# Altium schematic sheet AUDIO.SchDoc: param:Title
size A4; Author: param.Autor; Version: param:Version
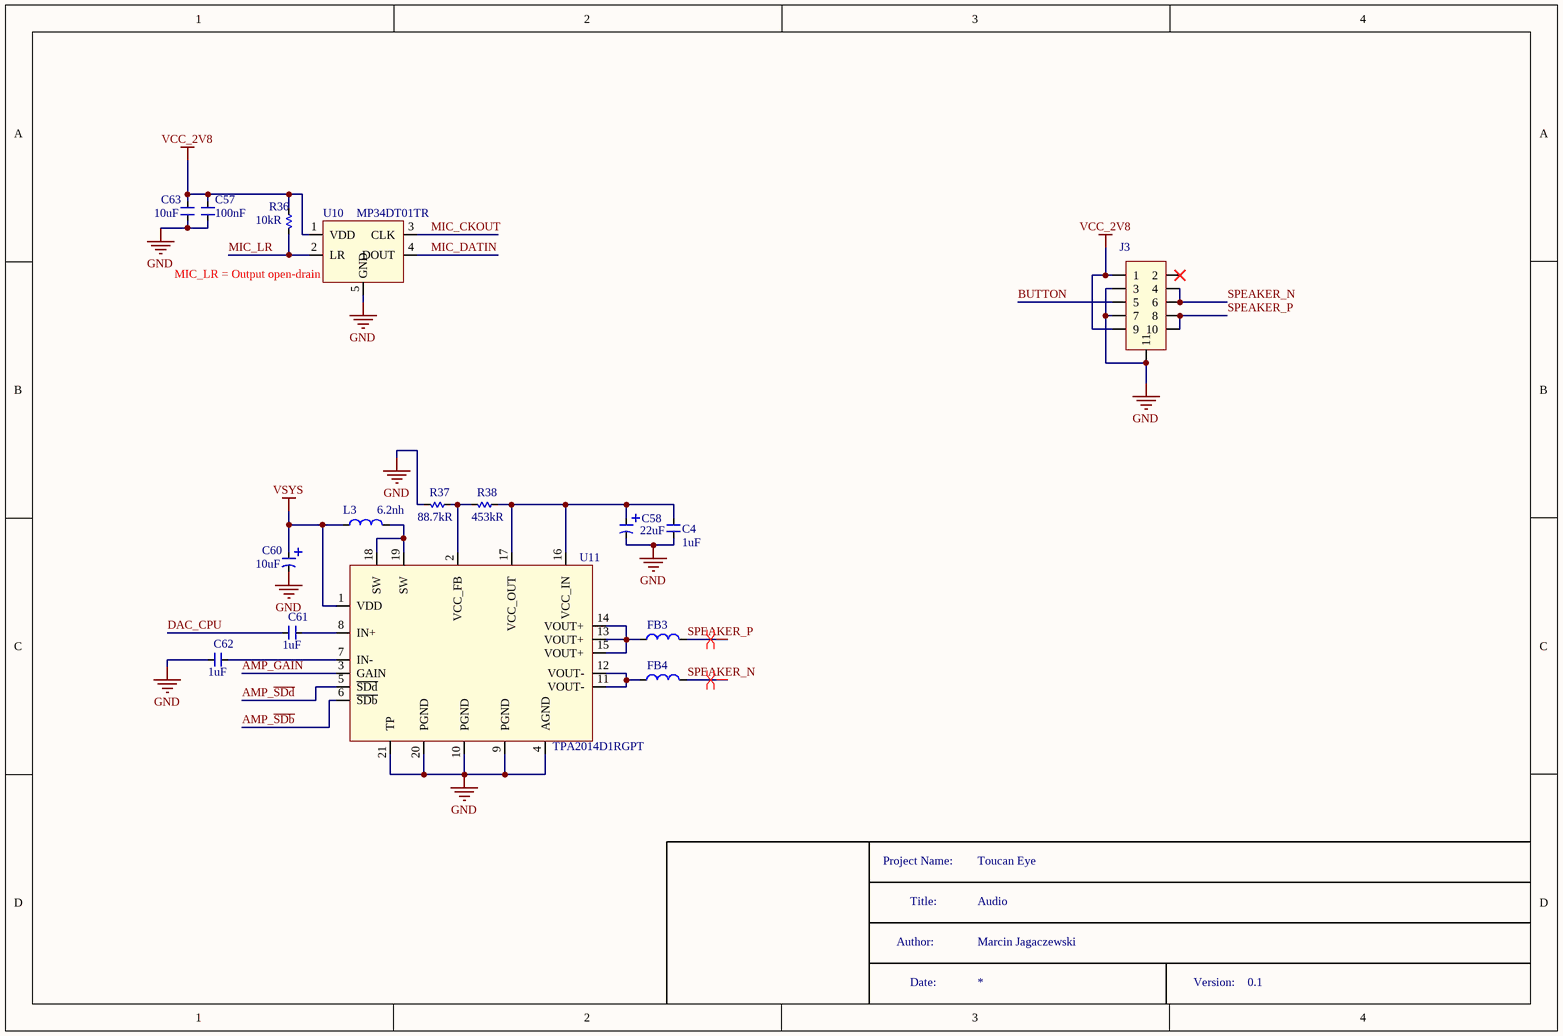
[diagram p0: AUDIO.SchDoc]

## Parts
C4  Capacitance: 1uF  [C_0402]  (hidden comment: C0402_1uF_TMK105BJ105MV-F)
C57  Capacitance: 100nF  [C_0201]  (hidden comment: C0201_100n_GRM033R6YA104KE14D)
C58  Capacitance: 22uF  [C_3216]  (hidden comment: C_22u_TANTAL_A_T491A226K006AT)
C60  Capacitance: 10uF  [C_3216]  (hidden comment: C_10u_TANTAL_A_T491A106K010AT7280)
C61  Capacitance: 1uF  [C_0402]  (hidden comment: C0402_1uF_TMK105BJ105MV-F)
C62  Capacitance: 1uF  [C_0402]  (hidden comment: C0402_1uF_TMK105BJ105MV-F)
C63  Capacitance: 10uF  [C_0402]  (hidden comment: C0402_10u_GRM155C80J106ME11D)
FB3  BLM18EG121SN1D  [L_0603]  (value not drawn)
FB4  BLM18EG121SN1D  [L_0603]  (value not drawn)
J3  BM10NB(0.6)-10DS-0.4V(51)  [BM10NB(0.6)-10DS-0.4V(51)]  (value not drawn)
L3  Inductance: 6.2nh  [L_0402]  (hidden comment: 744765062A)
R36  Resistance: 10kR  [R_0201]  (hidden comment: R0201_10k_ERJ-1GNF1002C)
R37  Resistance: 88.7kR  [R_0201]  (hidden comment: R0201_88.7k_ERJ-1GNF8872C)
R38  Resistance: 453kR  [R_0201]  (hidden comment: R0201_453k_RC0201FR-07453KL)
U10  MP34DT01TR  [HCLGA]
U11  TPA2014D1RGPT  [QFN_16x0,5]

## Nets
GND: C4.1 C57.1 C58.2 C60.2 C62.1 C63.1 J3.3 J3.7 J3.11 R37.1 U10.5(GND) U11.4(AGND) U11.9(PGND) U11.10(PGND) U11.20(PGND) U11.21(TP)
VCC_2V8: C57.2 C63.2 J3.1 J3.9 R36.2 U10.1(VDD)
VSYS: C60.1 L3.1(Vcc) U11.1(VDD)
AMP_GAIN: U11.3(GAIN)
AMP_~{SDb}: U11.6(~{SDb})
AMP_~{SDd}: U11.5(~{SDd})
BUTTON: J3.5
DAC_CPU: C61.1
MIC_CKOUT: U10.3(CLK)
MIC_DATIN: U10.4(DOUT)
MIC_LR: R36.1 U10.2(LR)
SPEAKER_N: FB4.2(Vcc) J3.4 J3.6
SPEAKER_P: FB3.2(Vcc) J3.8 J3.10
NetC4_2: C4.2 C58.1 R38.2 U11.16(VCC_IN) U11.17(VCC_OUT)
NetC61_2: C61.2 U11.8(IN+)
NetC62_2: C62.2 U11.7(IN-)
NetFB3_1: FB3.1(Vcc) U11.13(VOUT+) U11.14(VOUT+) U11.15(VOUT+)
NetFB4_1: FB4.1(Vcc) U11.11(VOUT-) U11.12(VOUT-)
NetL3_2: L3.2(Vcc) U11.18(SW) U11.19(SW)
NetR37_2: R37.2 R38.1 U11.2(VCC_FB)

Not connected (* = marked no-connect by the designer): J3 2*

## Layout directives
differential pair: SPEAKER_N, SPEAKER_P

## Notes on the sheet
- (near U10) MIC_LR = Output open-drain
- Project Name:
- Title:
- Audio
- Toucan Eye
- Author:
- Date:
- Marcin Jagaczewski
- Version:
- 0.1

## Library data of the parts
C4 C61 C62 = C0402_1uF_TMK105BJ105MV-F: CAP CER 1UF 25V X5R 0402; Manufacturer: Taiyo Yuden; Tolerance: 20%; *PCBChecked: 1; Supplier 1: Mouser; Manufacturer Part Number: TMK105BJ105MV-F; Stock 1: 60117; Pricing 1: 1=0.28, 10=0.098, 50=0.098, 100=0.054, 1000=0.028, 10000=0.019 (USD); Mount: Surface Mount; Case/Package: 0402; Case Code (Metric): 1005; Case Code (Imperial): 0402; Min Operating Temperature: -55°C; Max Operating Temperature: 85°C; Packaging: Tape and Reel; Package Quantity: 1; Voltage Rating (DC): 25V; Dielectric: X5R; Termination: SMD/SMT; Voltage Rating: 25V; Composition: Ceramic; Length: 1mm; Height: 0.5mm; Width: 0.02inch; Thickness: 0.022inch; Depth: 0.5mm; Radiation Hardening: No; Halogen Free: Halogen Free; ComponentLink1URL: https://datasheet.ciiva.com/30154/128tmk105bj105mv-f-30154639.pdf; ComponentLink1Description: https://datasheet.ciiva.com/30154/128tmk105bj105mv-f-30154639.pdf; ComponentLink2URL: https://datasheet.ciiva.com/15922/tmk105bj105mv-f-pdf-15922317.pdf; ComponentLink2Description: https://datasheet.ciiva.com/15922/tmk105bj105mv-f-pdf-15922317.pdf; ComponentLink3URL: https://datasheet.ciiva.com/11596/tmk105bj105mv-f-ss-11596466.pdf; ComponentLink3Description: https://datasheet.ciiva.com/11596/tmk105bj105mv-f-ss-11596466.pdf; ComponentLink4URL: https://datasheet.ciiva.com/13404/mlcc-all-e-541559-13404206.pdf; ComponentLink4Description: https://datasheet.ciiva.com/13404/mlcc-all-e-541559-13404206.pdf; *SCHChecked: 1; Supplier Part Number 1: 963-TMK105BJ105MV-F
C57 = C0201_100n_GRM033R6YA104KE14D: Multilayer Ceramic Capacitors MLCC - SMD/SMT 0201 0.10uF 35volts *Derate Voltage/Temp; Manufacturer: Murata; Tolerance: 10%; Dielectric: X5R; Voltage Rating (DC): 35V; Supplier 1: Mouser; Manufacturer Part Number: GRM033R6YA104KE14D; Stock 1: 295799; Pricing 1: 1=0.1, 10=0.061, 50=0.061, 100=0.027, 1000=0.015, 10000=0.01 (USD); Mount: Surface Mount; Case/Package: 0201; Weight: 1.2E-05oz; Case Code (Metric): 0603; Case Code (Imperial): 0201; Min Operating Temperature: -55°C; Max Operating Temperature: 85°C; Packaging: Tape and Reel; Voltage Rating: 35V; Termination: SMD/SMT; Package Quantity: 15000; Length: 0.024inch; Height: 0.3mm; Width: 0.3mm; Thickness: 0.013inch; ComponentLink1URL: http://www.mouser.com/ds/2/281/c02e-2905.pdf; ComponentLink1Description: http://www.mouser.com/ds/2/281/c02e-2905.pdf; ComponentLink2URL: http://search.murata.co.jp/Ceramy/image/img/A01X/partnumbering_e_01.pdf; ComponentLink2Description: http://search.murata.co.jp/Ceramy/image/img/A01X/partnumbering_e_01.pdf; *SCHChecked: *; *PCBChecked: *; Supplier Part Number 1: 81-GRM33R6YA104KE14D
C58 = C_22u_TANTAL_A_T491A226K006AT: Cap Tant Solid 22uF 6.3V A CASE 10% (3.2 X 1.6 X 1.6mm) SMD 3216-18 4 Ohm 125C T/R; Manufacturer: KEMET; Dielectric Material: Tantalum; ESR (Equivalent Series Resistance): 4R; Ripple Current: 137mA; Leakage Current: 1.4uA; Polarity: Polar; Dissipation Factor: 6%; Life (Hours): 2000Hour; *PCBChecked: 1; Supplier 1: Mouser; Manufacturer Part Number: T491A226K006AT; Stock 1: 2818; Pricing 1: 1=0.42, 10=0.239, 50=0.239, 100=0.144, 1000=0.118, 10000=0.08 (USD); Mount: Surface Mount,PCB; Case/Package: 1206; Number of Pins: 2; Case Code (Metric): 3216; Case Code (Imperial): 1206; Min Operating Temperature: -55°C; Max Operating Temperature: 125°C; Tolerance: 10%; Packaging: Tape and Reel; Voltage Rating: 6.3V; Package Quantity: 1; Failure Rate: 0.001%; Termination: SMD/SMT; Voltage: 6.3V; Voltage Rating (DC): 6.3V; Length: 3.2mm; Height: 1.6mm; Depth: 1.6mm; Width: 0.063inch; Height - Seated (Max): 0.071inch; Lead Pitch: 1.2mm; Radiation Hardening: No; Lead Free: Lead Free; REACH SVHC: No SVHC; ComponentLink1URL: https://datasheet.ciiva.com/12884/kem-t2005-t491-12884456.pdf; ComponentLink1Description: https://datasheet.ciiva.com/12884/kem-t2005-t491-12884456.pdf; ComponentLink2URL: https://datasheet.ciiva.com/6248/kem-t2005-t491-6248094.pdf; ComponentLink2Description: https://datasheet.ciiva.com/6248/kem-t2005-t491-6248094.pdf; ComponentLink3URL: https://datasheet.ciiva.com/28488/1854511-28488485.pdf; ComponentLink3Description: https://datasheet.ciiva.com/28488/1854511-28488485.pdf; ComponentLink4URL: https://datasheet.ciiva.com/5934/kem-t2005-t491-5934246.pdf; ComponentLink4Description: https://datasheet.ciiva.com/5934/kem-t2005-t491-5934246.pdf; *SCHChecked: 1; Supplier Part Number 1: 80-T491A226K006
C60 = C_10u_TANTAL_A_T491A106K010AT7280: CAP TANT 10UF 10V 10% 1206; Manufacturer: KEMET; ESR (Equivalent Series Resistance): 3.8R; Polarity: Polar; Dissipation Factor: 6%; Life (Hours): 2000Hour; Supplier 1: Mouser; Manufacturer Part Number: T491A106K010AT7280; Stock 1: 0; Pricing 1: 1=0.39, 10=0.223, 50=0.223, 100=0.134, 1000=0.096, 10000=0.074 (USD); Mount: Surface Mount; Case/Package: 1206; Case Code (Metric): 3216; Case Code (Imperial): 1206; Min Operating Temperature: -55°C; Max Operating Temperature: 125°C; Tolerance: 10%; Packaging: Tape and Reel; Voltage Rating: 10V; Package Quantity: 1; Termination: SMD/SMT; Resistance: 3.8R; Failure Rate: 0.001%; Length: 3.2mm; Height: 1.8mm; Depth: 1.6mm; Width: 0.063inch; Height - Seated (Max): 0.071inch; Lead Free: Lead Free; ComponentLink1URL: https://datasheet.ciiva.com/12911/kem-t2005-t491-12911022.pdf; ComponentLink1Description: https://datasheet.ciiva.com/12911/kem-t2005-t491-12911022.pdf; ComponentLink2URL: https://datasheet.ciiva.com/6248/kem-t2005-t491-6248182.pdf; ComponentLink2Description: https://datasheet.ciiva.com/6248/kem-t2005-t491-6248182.pdf; *SCHChecked: *; *PCBChecked: *; Supplier Part Number 1: 80-T491A106K107280
C63 = C0402_10u_GRM155C80J106ME11D: 10µF 6.3V Ceramic Capacitor X6S 0402 (1005 Metric) 0.039" L x 0.020" W (1.00mm x 0.50mm); Manufacturer: Murata; Tolerance: 20%; *SCHChecked: 1; Supplier 1: Mouser; Manufacturer Part Number: GRM155C80J106ME11D; Stock 1: 134415; Pricing 1: 1=0.17, 10=0.125, 50=0.125, 100=0.059, 1000=0.034, 10000=0.024 (USD); Mount: Surface Mount; Case/Package: 0402; Case Code (Metric): 1005; Case Code (Imperial): 0402; Min Operating Temperature: -55°C; Max Operating Temperature: 105°C; Packaging: Tape and Reel; Voltage Rating: 6.3V; Voltage Rating (DC): 6.3V; Dielectric: X6S; Length: 0.039inch; Width: 0.02inch; Thickness: 0.028inch; ComponentLink1URL: http://search.murata.co.jp/Ceramy/image/img/A01X/partnumbering_e_01.pdf; ComponentLink1Description: http://search.murata.co.jp/Ceramy/image/img/A01X/partnumbering_e_01.pdf; Supplier Part Number 1: 81-GRM155C80J106ME1D; *PCBChecked: 1
FB3 FB4 = BLM18EG121SN1D: MURATA         BLM18EG121SN1D            FERRITE BEAD, 0.04OHM, 2A, 0603; Material: Steel,Ferrite; DC Resistance (DCR): 40mR; Impedance: 120R; Tolerance: 25%; Test Frequency: 100MHz; Number of Lines: 1; Supplier 1: Mouser; Manufacturer: Murata; Manufacturer Part Number: BLM18EG121SN1D; Stock 1: 9180; Pricing 1: 1=0.23, 10=0.134, 50=0.134, 100=0.095, 1000=0.073, 10000=0.058 (USD); Case/Package: 0603; Number of Pins: 2; Weight: 7.1E-05oz; Core Material: Ferrite; Case Code (Metric): 1608; Case Code (Imperial): 0603; Min Operating Temperature: -55°C; Max Operating Temperature: 125°C; Packaging: Tape and Reel; Current Rating: 2A; Max DC Current: 2A; Package Quantity: 1; Max Current Rating: 2A; Termination: SMD/SMT; DC Current: 2A; Military Standard: Not; Frequency: 100MHz; Number of Circuits: 1; Length: 1.6mm; Height: 0.8mm; Width: 0.8mm; Depth: 0.8mm; Radiation Hardening: No; REACH SVHC: No SVHC; Lead Free: Lead Free; ComponentLink1URL: https://datasheet.ciiva.com/34302/1844926-34302803.pdf; ComponentLink1Description: https://datasheet.ciiva.com/34302/1844926-34302803.pdf; ComponentLink2URL: https://datasheet.ciiva.com/11795/0900766b811b5866-11795397.pdf; ComponentLink2Description: https://datasheet.ciiva.com/11795/0900766b811b5866-11795397.pdf; ComponentLink3URL: https://datasheet.ciiva.com/41449/001172264-da-01-en-drossel-0603-120r-1-6x0-8mm-4000st-41449582.pdf; ComponentLink3Description: https://datasheet.ciiva.com/41449/001172264-da-01-en-drossel-0603-120r-1-6x0-8mm-4000st-41449582.pdf; ComponentLink4URL: https://datasheet.ciiva.com/41449/001171698-da-01-en-chip-drossel0603-120r-2000ma-1-6x0-8mm-41449378.pdf; ComponentLink4Description: https://datasheet.ciiva.com/41449/001171698-da-01-en-chip-drossel0603-120r-2000ma-1-6x0-8mm-41449378.pdf; ComponentLink5URL: https://datasheet.ciiva.com/14122/blm-series-eng-tds-14122904.pdf; ComponentLink5Description: https://datasheet.ciiva.com/14122/blm-series-eng-tds-14122904.pdf; ComponentLink6URL: https://datasheet.ciiva.com/3081/l0110s0101blm18e-3081624.pdf; ComponentLink6Description: https://datasheet.ciiva.com/3081/l0110s0101blm18e-3081624.pdf; ComponentLink7URL: https://datasheet.ciiva.com/17279/l0110s0101blm18e-17279548.pdf; ComponentLink7Description: https://datasheet.ciiva.com/17279/l0110s0101blm18e-17279548.pdf; ComponentLink8URL: https://datasheet.ciiva.com/18092/getdatasheetpartid-120977-18092965.pdf; ComponentLink8Description: https://datasheet.ciiva.com/18092/getdatasheetpartid-120977-18092965.pdf; ComponentLink9URL: https://datasheet.ciiva.com/1467/5169-1467155.pdf; ComponentLink9Description: https://datasheet.ciiva.com/1467/5169-1467155.pdf; ComponentLink10URL: https://datasheet.ciiva.com/1467/5169-1467156.pdf; ComponentLink10Description: https://datasheet.ciiva.com/1467/5169-1467156.pdf; ComponentLink11URL: https://datasheet.ciiva.com/16387/l0110s0101blm18e-16387655.pdf; ComponentLink11Description: https://datasheet.ciiva.com/16387/l0110s0101blm18e-16387655.pdf; ComponentLink12URL: https://datasheet.ciiva.com/6211/l0110s0101blm18e-6211463.pdf; ComponentLink12Description: https://datasheet.ciiva.com/6211/l0110s0101blm18e-6211463.pdf; *SCHChecked: 1; *PCBChecked: 1; Supplier Part Number 1: 81-BLM18EG121SN1D
J3 = BM10NB(0.6)-10DS-0.4V(51): CONN RCPT 10POS 0.4MM SMD GOLD; Manufacturer: Hirose; Number of Positions: 10; Connector Type: Receptacle; Pitch: 0.016inch; Stack Height: 0.6mm; *SCHChecked: 1; Supplier 1: Mouser; Manufacturer Part Number: BM10NB(0.6)-10DS-0.4V(51); Stock 1: 3831; Pricing 1: 1=0.63, 10=0.501, 50=0.501, 100=0.414, 1000=0.326, 10000=0.263 (USD); Mount: Surface Mount; Contact Plating: Gold; Package Quantity: 1; Number of Rows: 2; Packaging: Tape and Reel; Termination: SMD/SMT; ComponentLink1URL: http://www.mouser.com/catalog/specsheets/BM10_Flyer.pdf; ComponentLink1Description: http://www.mouser.com/catalog/specsheets/BM10_Flyer.pdf; ComponentLink2URL: https://www.hirose.com/product/download/?distributor=digikey&type=2d&lang=en&num=BM10NB(0.6)-10DS-0.4V(51); ComponentLink2Description: https://www.hirose.com/product/download/?distributor=digikey&type=2d&lang=en&num=BM10NB(0.6)-10DS-0.4V(51); *PCBChecked: 1; Supplier Part Number 1: 798-BM10NB0610DS4V51
L3 = 744765062A: FIXED IND 6.2NH 760MA 83 MOHM; Manufacturer: Wurth Electronics; Material: Ceramic; Tolerance: 5%; Shielding: Unshielded; Frequency: 250MHz; Self Resonant Frequency: 5.8GHz; Q Factor: 23; Resistance: 83mR; *SCHChecked: 1; Supplier 1: Mouser; Manufacturer Part Number: 744765062A; Stock 1: 1056; Pricing 1: 1=0.41, 10=0.39, 50=0.363, 100=0.336, 1000=0.282, 10000=0.255 (USD); Mount: Surface Mount; Case/Package: 0402; Number of Pins: 2; Weight: 2.3E-05oz; Case Code (Metric): 1005; Case Code (Imperial): 0402; Core Material: Ceramic; Min Operating Temperature: -40°C; Max Operating Temperature: 125°C; Package Quantity: 3000; Current Rating: 760mA; Packaging: Tape and Reel; Inductance Tolerance: 5%; Composition: Wirewound,Ceramic; DC Resistance (DCR): 83mR; Test Frequency: 250MHz; Max DC Current: 760mA; Termination: SMD/SMT; Series Resistance: 83mR; Length: 1mm; Height: 0.5mm; Width: 0.55mm; Height - Seated (Max): 0.024inch; Depth: 0.55mm; REACH SVHC: Unknown; ComponentLink1URL: https://datasheet.ciiva.com/11803/0900766b80f88b46-11803524.pdf; ComponentLink1Description: https://datasheet.ciiva.com/11803/0900766b80f88b46-11803524.pdf; ComponentLink2URL: https://datasheet.ciiva.com/6027/426746-6027077.pdf; ComponentLink2Description: https://datasheet.ciiva.com/6027/426746-6027077.pdf; ComponentLink3URL: https://datasheet.ciiva.com/1049/744765062a-1049024.pdf; ComponentLink3Description: https://datasheet.ciiva.com/1049/744765062a-1049024.pdf; ComponentLink4URL: https://datasheet.ciiva.com/4978/744765062a-58674-4978771.pdf; ComponentLink4Description: https://datasheet.ciiva.com/4978/744765062a-58674-4978771.pdf; ComponentLink5URL: https://datasheet.ciiva.com/26308/744765062a-eng-tds-26308299.pdf; ComponentLink5Description: https://datasheet.ciiva.com/26308/744765062a-eng-tds-26308299.pdf; ComponentLink6URL: https://datasheet.ciiva.com/7695/426746-7695834.pdf; ComponentLink6Description: https://datasheet.ciiva.com/7695/426746-7695834.pdf; Supplier Part Number 1: 710-744765062A; *PCBChecked: 1
R36 = R0201_10k_ERJ-1GNF1002C: RESISTOR, 0201, 0.05W, 1%, 10K; Manufacturer: Panasonic ECG; Temperature Coefficient: 200ppm/°C; Power Rating: 50mW; Voltage Rating: 25V; *SCHChecked: 1; Supplier 1: Mouser; Manufacturer Part Number: ERJ-1GNF1002C; Stock 1: 896102; Pricing 1: 1=0.49, 10=0.045, 50=0.045, 100=0.018, 1000=0.013, 10000=0.007 (USD); Mount: Surface Mount; Case/Package: 0201; Number of Pins: 2; Contact Plating: Tin,Matte; Case Code (Metric): 0603; Case Code (Imperial): 0201; Min Operating Temperature: -55°C; Max Operating Temperature: 125°C; Tolerance: 1%; Composition: Thick Film; Packaging: Tape and Reel; Package Quantity: 15000; Number of Terminations: 2; Military Standard: Not; Max Power Dissipation: 50mW; Voltage Rating (DC): 25V; Length: 0.6mm; Height: 0.01inch; Width: 0.012inch; Depth: 0.3mm; Radiation Hardening: No; REACH SVHC: Unknown; Lead Free: Lead Free; ComponentLink1URL: https://datasheet.ciiva.com/16508/aoa0000ce2-16508478.pdf; ComponentLink1Description: https://datasheet.ciiva.com/16508/aoa0000ce2-16508478.pdf; ComponentLink2URL: https://datasheet.ciiva.com/28514/1678782-28514095.pdf; ComponentLink2Description: https://datasheet.ciiva.com/28514/1678782-28514095.pdf; ComponentLink3URL: https://datasheet.ciiva.com/28514/1678782-28514085.pdf; ComponentLink3Description: https://datasheet.ciiva.com/28514/1678782-28514085.pdf; ComponentLink4URL: https://datasheet.ciiva.com/43467/1678782-43467078.pdf; ComponentLink4Description: https://datasheet.ciiva.com/43467/1678782-43467078.pdf; *PCBChecked: 1; Supplier Part Number 1: 667-ERJ-1GNF1002C
R37 = R0201_88.7k_ERJ-1GNF8872C: Thick Film Resistors - SMD 0201 88.7Kohm 1% Halogen Free; Manufacturer: Panasonic ECG; Power Rating: 50mW; Voltage Rating: 25V; Temperature Coefficient: 200ppm/°C; *SCHChecked: 1; Supplier 1: Mouser; Manufacturer Part Number: ERJ-1GNF8872C; Stock 1: 34794; Pricing 1: 1=0.49, 10=0.045, 50=0.045, 100=0.018, 1000=0.013, 10000=0.007 (USD); Mount: Surface Mount; Case/Package: 0201; Case Code (Imperial): 0201; Case Code (Metric): 0603; Contact Plating: Tin,Matte; Min Operating Temperature: -55°C; Max Operating Temperature: 125°C; Tolerance: 1%; Packaging: Tape and Reel; Package Quantity: 15000; Composition: Thick Film; Number of Terminations: 2; Max Power Dissipation: 50mW; Length: 0.024inch; Height: 0.01inch; Width: 0.3mm; Radiation Hardening: No; ComponentLink1URL: https://datasheet.ciiva.com/24026/aoa0000ce2-24026679.pdf; ComponentLink1Description: https://datasheet.ciiva.com/24026/aoa0000ce2-24026679.pdf; Supplier Part Number 1: 667-ERJ-1GNF8872C; *PCBChecked: 1
R38 = R0201_453k_RC0201FR-07453KL: Res Thick Film 0201 453K Ohm 1% 0.05W(1/20W) ±200ppm/C Molded SMD Paper T/R; Manufacturer: Yageo; Power Rating: 50mW; Temperature Coefficient: 200ppm/°C; *SCHChecked: 1; Supplier 1: Mouser; Manufacturer Part Number: RC0201FR-07453KL; Stock 1: 21967; Pricing 1: 1=0.1, 10=0.029, 50=0.029, 100=0.01, 1000=0.007, 10000=0.004 (USD); Case/Package: 0201; Case Code (Metric): 0603; Case Code (Imperial): 0201; Min Operating Temperature: -55°C; Max Operating Temperature: 125°C; Tolerance: 1%; Packaging: Tape and Reel; Composition: Thick Film; Number of Terminations: 2; Military Standard: Not; Max Power Dissipation: 50mW; Length: 0.024inch; Height: 0.01inch; Width: 0.012inch; Depth: 0.3mm; Lead Free: Lead Free; ComponentLink1URL: http://components.arrow.com/part/dataview/0323_03291826; ComponentLink1Description: http://components.arrow.com/part/dataview/0323_03291826; ComponentLink2URL: http://www.yageo.com.tw/exep/pages/download/literatures/PYu-R_INT-thick_7.pdf; ComponentLink2Description: http://www.yageo.com.tw/exep/pages/download/literatures/PYu-R_INT-thick_7.pdf; ComponentLink3URL: http://www.yageo.com/documents/recent/PYu-RC0201_51_RoHS_L_(8).pdf; ComponentLink3Description: http://www.yageo.com/documents/recent/PYu-RC0201_51_RoHS_L_(8).pdf; Supplier Part Number 1: 603-RC0201FR-07453KL; *PCBChecked: 1
U10 = MP34DT01TR: MIC MEMS DIGITAL PDM OMNI -26DB; Manufacturer: STMicroelectronics; Shape: Rectangular; Max Supply Voltage: 3.6V; Operating Supply Voltage: 1.8V; Min Supply Voltage: 1.64V; Operating Supply Current: 600uA; Direction: Omnidirectional; Number of Channels: 2; Signal to Noise Ratio (SNR): 63dB; *SCHChecked: 1; Supplier 1: Mouser; Manufacturer Part Number: MP34DT01TR; Stock 1: 10769; Pricing 1: 1=1.48, 10=1.25, 50=1.25, 100=1, 1000=0.725, 10000=0.625 (USD); Contact Plating: Nickel,Gold; Min Operating Temperature: -40°C; Max Operating Temperature: 85°C; Packaging: Tape and Reel; Voltage Rating: 3.6V; Termination: SMD/SMT; Output Type: Digital; Package Quantity: 4000; Length: 4mm; Height: 1.1mm; Width: 3mm; Depth: 1mm; Lead Free: Lead Free; ComponentLink1URL: https://datasheet.ciiva.com/15098/getdatasheetpartid-495516-15098984.pdf; ComponentLink1Description: https://datasheet.ciiva.com/15098/getdatasheetpartid-495516-15098984.pdf; ComponentLink2URL: https://datasheet.ciiva.com/5300/dm00039779-100783-5300131.pdf; ComponentLink2Description: https://datasheet.ciiva.com/5300/dm00039779-100783-5300131.pdf; ComponentLink3URL: https://datasheet.ciiva.com/1/dm00039779-1998.pdf; ComponentLink3Description: https://datasheet.ciiva.com/1/dm00039779-1998.pdf; ComponentLink4URL: https://datasheet.ciiva.com/1/dm00039779-1997.pdf; ComponentLink4Description: https://datasheet.ciiva.com/1/dm00039779-1997.pdf; ComponentLink5URL: https://datasheet.ciiva.com/1/dm00039779-1996.pdf; ComponentLink5Description: https://datasheet.ciiva.com/1/dm00039779-1996.pdf; Supplier Part Number 1: 511-MP34DT01TR; *PCBChecked: 1
U11 = TPA2014D1RGPT: IC AMP AUDIO PWR 1.5W D 20QFN; Manufacturer: Texas Instruments; Max Dual Supply Voltage: 5.5V; Voltage Gain: 20dB; Common Mode Rejection Ratio: 75dB; Max Power Dissipation: 2.5W; Dual Supply Voltage: 5V; Supply Type: Dual; Power Supply Rejection Ratio (PSRR): -91dB; *SCHChecked: 1; Supplier 1: Mouser; Stock 1: 117; Pricing 1: 1=2.27, 10=1.93, 50=1.93, 100=1.54, 1000=1.12, 10000=1.01 (USD); Case/Package: VQFN EP; Number of Pins: 20; Weight: 0.00163oz; Min Operating Temperature: -40°C; Max Operating Temperature: 85°C; Packaging: Tape and Reel; Output Power: 1.5W; Package Quantity: 1; Gain: 20dB; Max Output Power: 1.5W; Power Dissipation: 2.5W; Radiation Hardening: No; Lead Free: Lead Free; ComponentLink1URL: https://datasheet.ciiva.com/26117/slas559a-26117109.pdf; ComponentLink1Description: https://datasheet.ciiva.com/26117/slas559a-26117109.pdf; ComponentLink2URL: https://datasheet.ciiva.com/15131/getdatasheetpartid-48210-15131592.pdf; ComponentLink2Description: https://datasheet.ciiva.com/15131/getdatasheetpartid-48210-15131592.pdf; ComponentLink3URL: https://datasheet.ciiva.com/2969/tpa2014d1-2969824.pdf; ComponentLink3Description: https://datasheet.ciiva.com/2969/tpa2014d1-2969824.pdf; ComponentLink4URL: https://datasheet.ciiva.com/1789/tpa2014d1-1789239.pdf; ComponentLink4Description: https://datasheet.ciiva.com/1789/tpa2014d1-1789239.pdf; ComponentLink5URL: https://datasheet.ciiva.com/1789/tpa2014d1-1789237.pdf; ComponentLink5Description: https://datasheet.ciiva.com/1789/tpa2014d1-1789237.pdf; ComponentLink6URL: https://datasheet.ciiva.com/2967/tpa2014d1-2967858.pdf; ComponentLink6Description: https://datasheet.ciiva.com/2967/tpa2014d1-2967858.pdf; ComponentLink7URL: https://datasheet.ciiva.com/1789/tpa2014d1-1789238.pdf; ComponentLink7Description: https://datasheet.ciiva.com/1789/tpa2014d1-1789238.pdf; ComponentLink8URL: https://datasheet.ciiva.com/48706/001071077-da-01-en-ic-amp-audio-pw-tpa2014d1rgpt-qfn-20-tid-48706871.pdf; ComponentLink8Description: https://datasheet.ciiva.com/48706/001071077-da-01-en-ic-amp-audio-pw-tpa2014d1rgpt-qfn-20-tid-48706871.pdf; Supplier Part Number 1: 595-TPA2014D1RGPT; *PCBChecked: 1; Manufacturer Part Number: TPA2014D1RGPT